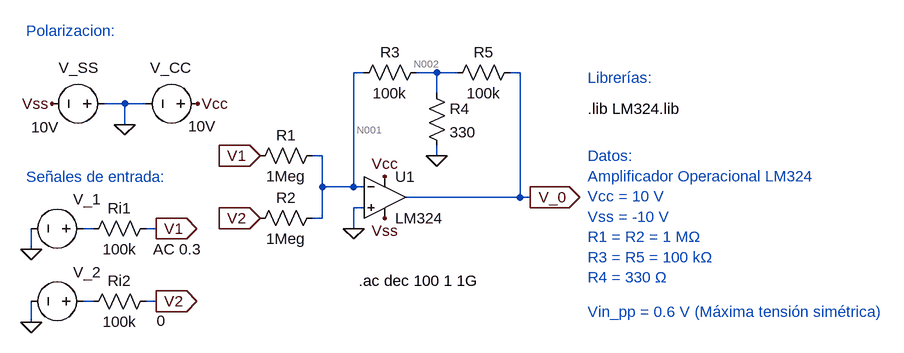
[diagram p0: schematic Lab_2_Circ_1_Ri=100k+Respuesta en frecuencia.asc]
Lab_2_Circ_1_Ri=100k+Respuesta en frecuencia.asc, the LTspice schematic file:
Version 4
SHEET 1 1708 680
WIRE 704 -304 688 -304
WIRE 816 -304 784 -304
WIRE 848 -304 816 -304
WIRE 944 -304 928 -304
WIRE 816 -272 816 -304
WIRE 336 -256 304 -256
WIRE 368 -256 336 -256
WIRE 336 -224 336 -256
WIRE 640 -176 624 -176
WIRE 816 -176 816 -192
WIRE 640 -128 640 -176
WIRE 688 -128 688 -304
WIRE 688 -128 640 -128
WIRE 704 -128 688 -128
WIRE 944 -112 944 -304
WIRE 944 -112 768 -112
WIRE 960 -112 944 -112
WIRE 704 -96 688 -96
WIRE 640 -80 640 -128
WIRE 640 -80 624 -80
WIRE 288 -64 272 -64
WIRE 384 -64 368 -64
WIRE 688 -64 688 -96
WIRE 192 -32 192 -64
WIRE 288 48 272 48
WIRE 384 48 368 48
WIRE 192 80 192 48
FLAG 688 -64 0
FLAG 448 -256 Vcc
FLAG 736 -144 Vcc
FLAG 224 -256 Vss
FLAG 736 -80 Vss
FLAG 336 -224 0
FLAG 544 -176 V1
IOPIN 544 -176 In
FLAG 544 -80 V2
IOPIN 544 -80 In
FLAG 960 -112 V_0
IOPIN 960 -112 Out
FLAG 816 -176 0
FLAG 192 -32 0
FLAG 384 -64 V1
IOPIN 384 -64 Out
FLAG 192 80 0
FLAG 384 48 V2
IOPIN 384 48 Out
SYMBOL OpAmps\\opamp2 736 -176 R0
SYMATTR InstName U1
SYMATTR Value LM324
SYMBOL res 800 -288 R0
SYMATTR InstName R4
SYMATTR Value 330
SYMBOL res 640 -192 R90
WINDOW 0 0 56 VBottom 2
WINDOW 3 32 56 VTop 2
SYMATTR InstName R1
SYMATTR Value 1Meg
SYMBOL res 272 -48 R270
WINDOW 0 32 56 VTop 2
WINDOW 3 0 56 VBottom 2
SYMATTR InstName Ri1
SYMATTR Value 100k
SYMBOL voltage 464 -256 R90
WINDOW 0 -55 25 VRight 2
WINDOW 3 35 -12 VRight 2
WINDOW 123 0 0 Left 0
WINDOW 39 0 0 Left 0
SYMATTR InstName V_CC
SYMATTR Value 10V
SYMBOL voltage 320 -256 R90
WINDOW 0 -55 25 VRight 2
WINDOW 3 36 85 VRight 2
WINDOW 123 0 0 Left 0
WINDOW 39 0 0 Left 0
SYMATTR InstName V_SS
SYMATTR Value 10V
SYMBOL res 688 -288 R270
WINDOW 0 32 56 VTop 2
WINDOW 3 0 56 VBottom 2
SYMATTR InstName R3
SYMATTR Value 100k
SYMBOL res 832 -288 R270
WINDOW 0 32 56 VTop 2
WINDOW 3 0 56 VBottom 2
SYMATTR InstName R5
SYMATTR Value 100k
SYMBOL res 640 -96 R90
WINDOW 0 0 56 VBottom 2
WINDOW 3 32 56 VTop 2
SYMATTR InstName R2
SYMATTR Value 1Meg
SYMBOL res 272 64 R270
WINDOW 0 32 56 VTop 2
WINDOW 3 0 56 VBottom 2
SYMATTR InstName Ri2
SYMATTR Value 100k
SYMBOL voltage 288 -64 M270
WINDOW 0 45 31 VLeft 2
WINDOW 3 1 -53 VLeft 2
WINDOW 123 -32 -92 VLeft 2
WINDOW 39 0 0 Left 0
SYMATTR InstName V_1
SYMATTR Value ""
SYMATTR Value2 AC 0.3
SYMBOL voltage 288 48 M270
WINDOW 0 45 31 VLeft 2
WINDOW 3 -30 -97 VLeft 2
WINDOW 123 0 0 Left 0
WINDOW 39 0 0 Left 0
SYMATTR InstName V_2
SYMATTR Value 0
TEXT 1048 -248 Left 2 !.lib LM324.lib
TEXT 1048 -296 Left 2 ;Librerías:
TEXT 184 -368 Left 2 ;Polarizacion:
TEXT 184 -144 Left 2 ;Señales de entrada:
TEXT 1048 -176 Left 2 ;Datos:\nAmplificador Operacional LM324\nVcc = 10 V\nVss = -10 V\nR1 = R2 = 1 MΩ\nR3 = R5 = 100 kΩ\nR4 = 330 Ω
TEXT 696 16 Left 2 !.ac dec 100 1 1G
TEXT 1048 64 Left 2 ;Vin_pp = 0.6 V (Máxima tensión simétrica)

The netlist it stands for:
* Lab_2_Circ_1_Ri=100k+Respuesta en frecuencia.asc
XU1 0 N001 Vcc Vss V_0 LM324  ; pins In+ In- V+ V- OUT
R4 N002 0 330
R1 N001 V1 1Meg
Ri1 N003 V1 100k
V_CC Vcc 0 10V
V_SS 0 Vss 10V
R3 N001 N002 100k
R5 N002 V_0 100k
R2 N001 V2 1Meg
Ri2 N004 V2 100k
V_1 N003 0 AC 0.3
V_2 N004 0 0
.lib LM324.lib
* Librerías:
* Polarizacion:
* Señales de entrada:
* Datos:
* Amplificador Operacional LM324
* Vcc = 10 V
* Vss = -10 V
* R1 = R2 = 1 MΩ
* R3 = R5 = 100 kΩ
* R4 = 330 Ω
.ac dec 100 1 1G
* Vin_pp = 0.6 V (Máxima tensión simétrica)
.backanno
.end

* Results of the author's LTspice run, read from the files saved beside the schematic
* Operating Point, zero values left out:
*   V(v_0) = -618 mV
*   V(vss) = -10 V
*   V(vcc) = 10 V
*   V(n001) = -27.44 µV
*   V(n002) = -2.026 mV
*   V(v1) = -2.495 µV
*   V(v2) = -2.495 µV
*   I(Ri2) = 24.95 pA
*   I(R2) = -24.95 pA
*   I(R5) = 6.16 µA
*   I(R3) = 19.99 nA
*   I(Ri1) = 24.95 pA
*   I(R1) = -24.95 pA
*   I(R4) = -6.14 µA
*   I(V_2) = -24.95 pA
*   I(V_1) = -24.95 pA
*   I(V_ss) = -669.8 µA
*   I(V_cc) = -669.9 µA
*   Ix(u1:1) = -19.92 nA
*   Ix(u1:2) = -19.94 nA
*   Ix(u1:3) = 669.9 µA
*   Ix(u1:4) = -669.8 µA
*   Ix(u1:5) = 6.16 µA